# EAGLE design Adapter Board (EAGLE 5.11)
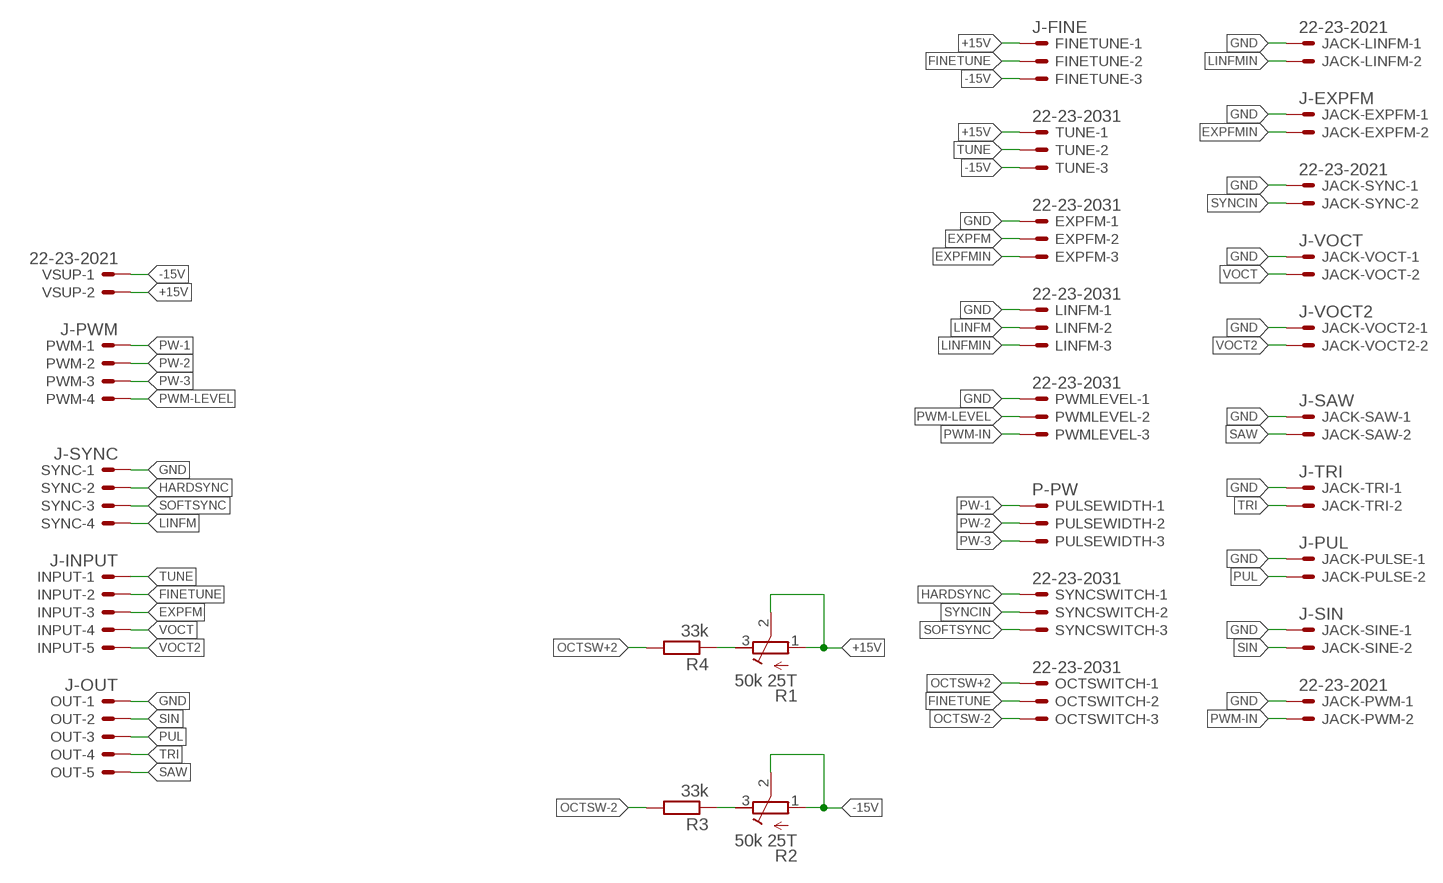
[diagram p0: schematic, sheet 1]

## Parts
EXPFM  22-23-2031  [22-23-2031]
FINETUNE  J-FINE  22-23-2031  [22-23-2031]
INPUT  J-INPUT  22-23-2051  [22-23-2051]
JACK-EXPFM  J-EXPFM  22-23-2021  [22-23-2021]
JACK-LINFM  22-23-2021  [22-23-2021]
JACK-PULSE  J-PUL  22-23-2021  [22-23-2021]
JACK-PWM  22-23-2021  [22-23-2021]
JACK-SAW  J-SAW  22-23-2021  [22-23-2021]
JACK-SINE  J-SIN  22-23-2021  [22-23-2021]
JACK-SYNC  22-23-2021  [22-23-2021]
JACK-TRI  J-TRI  22-23-2021  [22-23-2021]
JACK-VOCT  J-VOCT  22-23-2021  [22-23-2021]
JACK-VOCT2  J-VOCT2  22-23-2021  [22-23-2021]
LINFM  22-23-2031  [22-23-2031]
OCTSWITCH  22-23-2031  [22-23-2031]
OUT  J-OUT  22-23-2051  [22-23-2051]
PULSEWIDTH  P-PW  22-23-2031  [22-23-2031]
PWM  J-PWM  22-23-2041  [22-23-2041]
PWMLEVEL  22-23-2031  [22-23-2031]
R1  50k 25T  R-TRIMM64Y  [RTRIM64Y]
R2  50k 25T  R-TRIMM64Y  [RTRIM64Y]
R3  33k  R-EU_0207/10  [0207/10]
R4  33k  R-EU_0207/10  [0207/10]
SYNC  J-SYNC  22-23-2041  [22-23-2041]
SYNCSWITCH  22-23-2031  [22-23-2031]
TUNE  22-23-2031  [22-23-2031]
VSUP  22-23-2021  [22-23-2021]

## Nets
+15V: FINETUNE.1 R1.1(E) R1.2(S) TUNE.1 VSUP.2
-15V: FINETUNE.3 R2.1(E) R2.2(S) TUNE.3 VSUP.1
EXPFM: EXPFM.2 INPUT.3
EXPFMIN: EXPFM.3 JACK-EXPFM.2
FINETUNE: FINETUNE.2 INPUT.2 OCTSWITCH.2
GND: EXPFM.1 JACK-EXPFM.1 JACK-LINFM.1 JACK-PULSE.1 JACK-PWM.1 JACK-SAW.1 JACK-SINE.1 JACK-SYNC.1 JACK-TRI.1 JACK-VOCT2.1 JACK-VOCT.1 LINFM.1 OUT.1 PWMLEVEL.1 SYNC.1
HARDSYNC: SYNC.2 SYNCSWITCH.1
LINFM: LINFM.2 SYNC.4
LINFMIN: JACK-LINFM.2 LINFM.3
N$1: R1.3(A) R4.1
N$2: R2.3(A) R3.1
OCTSW+2: OCTSWITCH.1 R4.2
OCTSW-2: OCTSWITCH.3 R3.2
PUL: JACK-PULSE.2 OUT.3
PW-1: PULSEWIDTH.1 PWM.1
PW-2: PULSEWIDTH.2 PWM.2
PW-3: PULSEWIDTH.3 PWM.3
PWM-IN: JACK-PWM.2 PWMLEVEL.3
PWM-LEVEL: PWM.4 PWMLEVEL.2
SAW: JACK-SAW.2 OUT.5
SIN: JACK-SINE.2 OUT.2
SOFTSYNC: SYNC.3 SYNCSWITCH.3
SYNCIN: JACK-SYNC.2 SYNCSWITCH.2
TRI: JACK-TRI.2 OUT.4
TUNE: INPUT.1 TUNE.2
VOCT: INPUT.4 JACK-VOCT.2
VOCT2: INPUT.5 JACK-VOCT2.2

## Library data of the parts
EXPFM FINETUNE LINFM OCTSWITCH PULSEWIDTH PWMLEVEL SYNCSWITCH TUNE = con-molex:22-23-2031: .100" (2.54mm) Center Header - 3 Pin; MF: MOLEX; MPN: 22-23-2031; OC_FARNELL: 1462950; OC_NEWARK: 30C0862
INPUT OUT = con-molex:22-23-2051: .100" (2.54mm) Center Header - 5 Pin; MF: MOLEX; MPN: 22-23-2051; OC_FARNELL: 1462952; OC_NEWARK: 38C9178
JACK-EXPFM JACK-LINFM JACK-PULSE JACK-PWM JACK-SAW JACK-SINE JACK-SYNC JACK-TRI JACK-VOCT JACK-VOCT2 VSUP = con-molex:22-23-2021: .100" (2.54mm) Center Header - 2 Pin; MF: MOLEX; MPN: 22-23-2021; OC_FARNELL: 1462926; OC_NEWARK: 25C3832
PWM SYNC = con-molex:22-23-2041: .100" (2.54mm) Center Header - 4 Pin; MF: MOLEX; MPN: 22-23-2041; OC_FARNELL: 1462920; OC_NEWARK: 38C0355
R1 R2 = resistor:R-TRIMM: Trimm resistor
R3 R4 = resistor:R-EU_: RESISTOR, European symbol

## Board
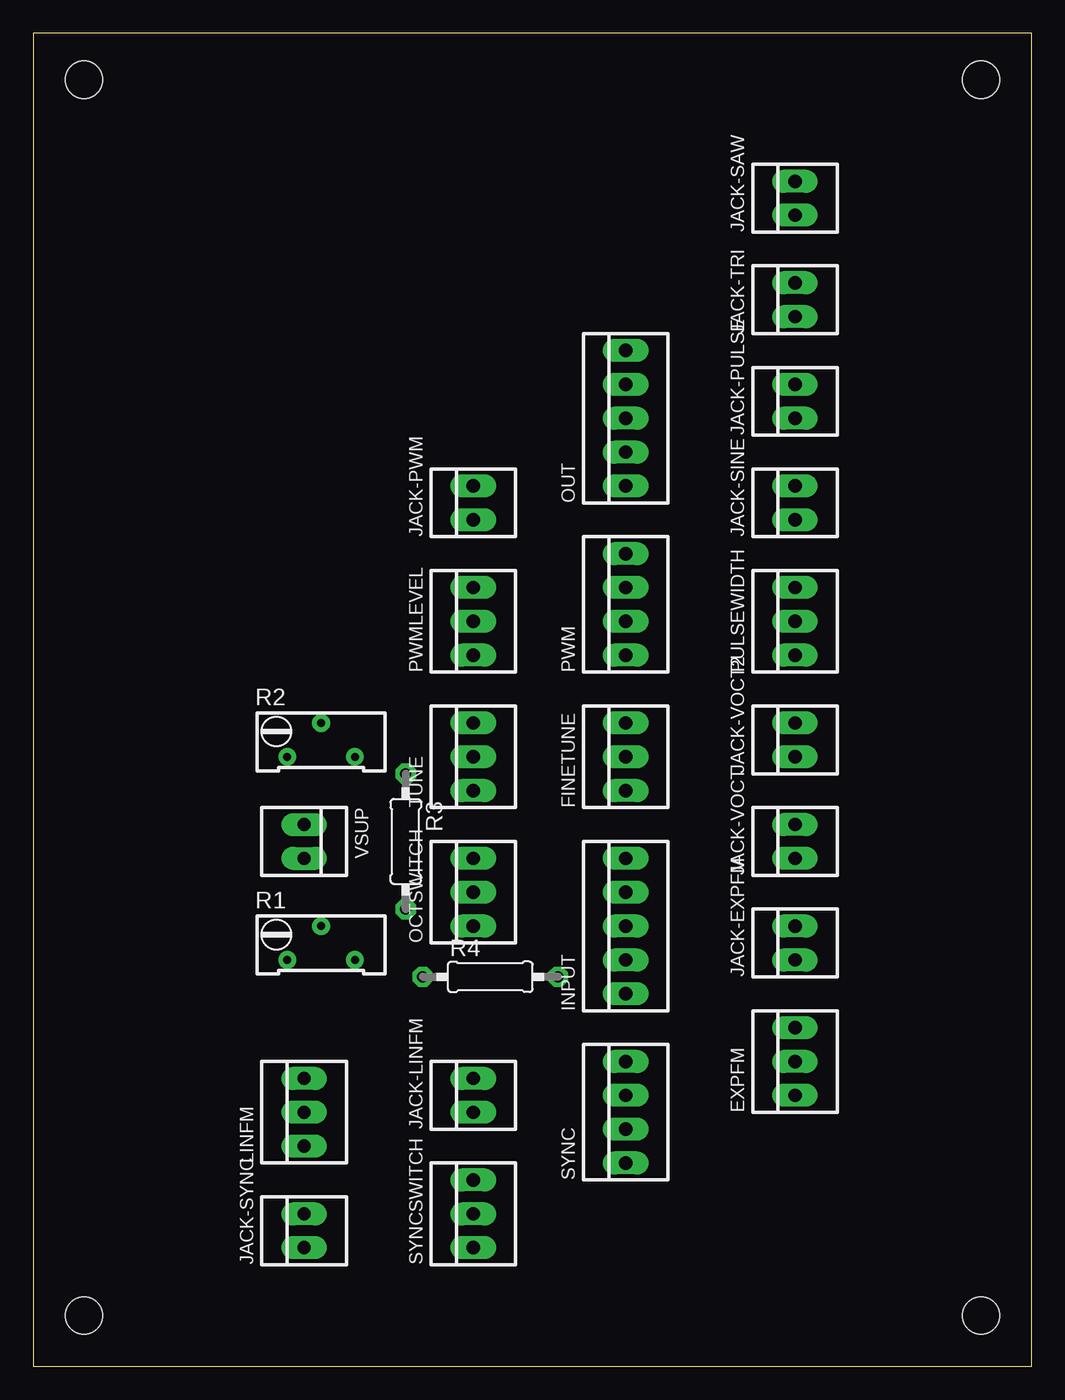
[diagram p1: board, top side]
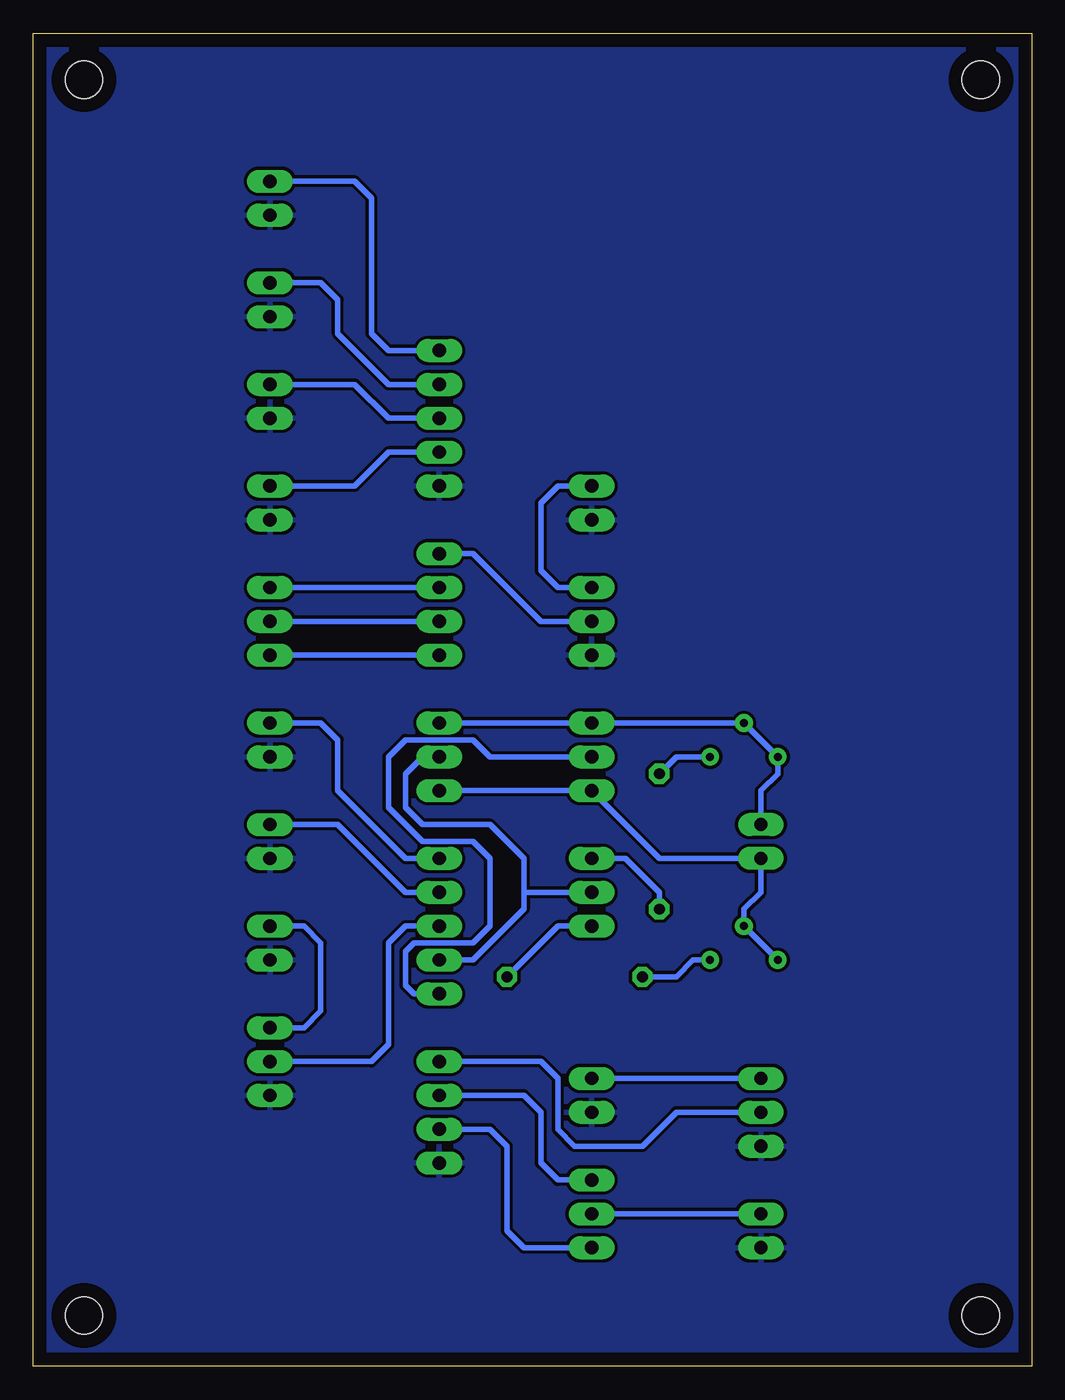
[diagram p2: board, bottom side, seen from below]

Size 74.91 x 100 mm. Coordinates in mm from the lower left corner, seen from the top.
Outline: 0,0 74.91,0 74.91,100 0,100 0,0
Copper layers (1*16): Top 0.035mm / dielectric 1.5mm / Bottom 0.035mm
Design rules "default *": minimum track width 10mil, minimum drill 24mil, track to track 10mil, track to pad 8mil, pad to pad 10mil, via to via 8mil, smd to smd 8mil, copper to edge 40mil, drill to drill 8mil, minimum pad ring 14mil, minimum via ring 8mil, stop-mask expansion 4mil, vias tented up to drill 0mil, thermal gap 10mil
Holes 2.8 mm at 3.81,96.52 71.12,96.52 71.12,3.81 3.81,3.81

### Footprints (pad centres in the part's own frame; a part is rotated, then mirrored left to right if it is on the bottom)
22-23-2031 = drill 1 long: 1 -2.54,0; 2 0,0; 3 2.54,0
22-23-2051 = drill 1 long: 1 -5.08,0; 2 -2.54,0; 3 0,0; 4 2.54,0; 5 5.08,0
22-23-2021 = drill 1 long: 1 -1.27,0; 2 1.27,0
22-23-2041 = drill 1 long: 1 -3.81,0; 2 -1.27,0; 3 1.27,0; 4 3.81,0
RTRIM64Y = drill 0.61 round: 1 0,-2.54; 2 -2.54,0; 3 0,2.54
0207/10 = drill 0.813 octagon: 1 -5.08,0; 2 5.08,0

### Placement (x,y rotation side)
EXPFM  57.15,22.86 90 top
FINETUNE  44.45,45.72 90 top
INPUT  44.45,33.02 90 top
JACK-EXPFM  57.15,31.75 90 top
JACK-LINFM  33.02,20.32 90 top
JACK-PULSE  57.15,72.39 90 top
JACK-PWM  33.02,64.77 90 top
JACK-SAW  57.15,87.63 90 top
JACK-SINE  57.15,64.77 90 top
JACK-SYNC  20.32,10.16 90 top
JACK-TRI  57.15,80.01 90 top
JACK-VOCT  57.15,39.37 90 top
JACK-VOCT2  57.15,46.99 90 top
LINFM  20.32,19.05 90 top
OCTSWITCH  33.02,35.56 90 top
OUT  44.45,71.12 90 top
PULSEWIDTH  57.15,55.88 90 top
PWM  44.45,57.15 90 top
PWMLEVEL  33.02,55.88 90 top
R1  21.59,30.48 270 top
R2  21.59,45.72 270 top
R3  27.94,39.37 270 top
R4  34.29,29.21 0 top
SYNC  44.45,19.05 90 top
SYNCSWITCH  33.02,11.43 90 top
TUNE  33.02,45.72 90 top
VSUP  20.32,39.37 270 top

### Tracks (layer width: path | path; a pad name or v marks a point on that pad's centre or on a via)
+15V
  Bottom 0.406: R1.1 R1.2 21.59,34.29 20.32,35.56 VSUP.2 27.94,38.1 TUNE.1 FINETUNE.1
-15V
  Bottom 0.406: VSUP.1 20.32,43.18 19.05,44.45 R2.1 R2.2 TUNE.3 FINETUNE.3
EXPFM
  Bottom 0.406: INPUT.3 46.99,33.02 48.26,31.75 48.26,24.13 49.53,22.86 EXPFM.2
EXPFMIN
  Bottom 0.406: EXPFM.3 54.61,25.4 53.34,26.67 53.34,31.75 54.61,33.02 JACK-EXPFM.2
FINETUNE
  Bottom 0.406: OCTSWITCH.2 38.1,35.56 | FINETUNE.2 45.72,45.72 46.99,44.45 46.99,41.91 45.72,40.64 40.64,40.64 38.1,38.1 38.1,35.56 | INPUT.2 41.91,30.48 38.1,34.29 38.1,35.56
GND
  pour Bottom: 0,100.33 74.93,100.33 74.93,0 0,0
HARDSYNC
  Bottom 0.406: SYNC.2 40.64,17.78 39.37,16.51 39.37,10.16 38.1,8.89 SYNCSWITCH.1
LINFM
  Bottom 0.406: LINFM.2 26.67,19.05 29.21,16.51 34.29,16.51 35.56,17.78 35.56,21.59 36.83,22.86 SYNC.4
LINFMIN
  Bottom 0.406: LINFM.3 JACK-LINFM.2
N$1
  Bottom 0.406: R1.3 25.4,30.48 26.67,29.21 R4.1
N$2
  Bottom 0.406: R2.3 26.67,45.72 R3.1
OCTSW+2
  Bottom 0.406: OCTSWITCH.1 35.56,33.02 R4.2
OCTSW-2
  Bottom 0.406: R3.2 27.94,35.56 30.48,38.1 OCTSWITCH.3
PUL
  Bottom 0.406: OUT.3 48.26,71.12 50.8,73.66 JACK-PULSE.2
PW-1
  Bottom 0.406: PWM.1 PULSEWIDTH.1
PW-2
  Bottom 0.406: PWM.2 PULSEWIDTH.2
PW-3
  Bottom 0.406: PWM.3 PULSEWIDTH.3
PWM-IN
  Bottom 0.406: PWMLEVEL.3 35.56,58.42 36.83,59.69 36.83,64.77 35.56,66.04 JACK-PWM.2
PWM-LEVEL
  Bottom 0.406: PWM.4 41.91,60.96 36.83,55.88 PWMLEVEL.2
SAW
  Bottom 0.406: JACK-SAW.2 50.8,88.9 49.53,87.63 49.53,77.47 48.26,76.2 OUT.5
SIN
  Bottom 0.406: OUT.2 48.26,68.58 50.8,66.04 JACK-SINE.2
SOFTSYNC
  Bottom 0.406: SYNCSWITCH.3 35.56,13.97 36.83,15.24 36.83,19.05 38.1,20.32 SYNC.3
SYNCIN
  Bottom 0.406: JACK-SYNC.2 SYNCSWITCH.2
TRI
  Bottom 0.406: OUT.4 48.26,73.66 52.07,77.47 52.07,80.01 53.34,81.28 JACK-TRI.2
TUNE
  Bottom 0.406: TUNE.2 40.64,45.72 41.91,46.99 46.99,46.99 48.26,45.72 48.26,41.91 45.72,39.37 41.91,39.37 40.64,38.1 40.64,33.02 41.91,31.75 46.35,31.75 46.99,31.11 46.99,28.57 46.35,27.94 INPUT.1
VOCT
  Bottom 0.406: INPUT.4 46.99,35.56 52.07,40.64 JACK-VOCT.2
VOCT2
  Bottom 0.406: INPUT.5 46.99,38.1 52.07,43.18 52.07,46.99 53.34,48.26 JACK-VOCT2.2